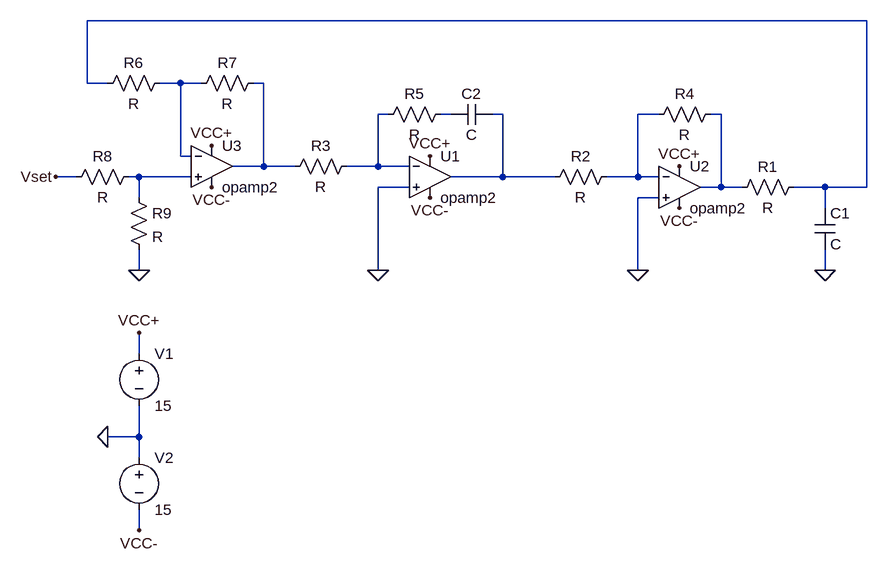
[diagram p0: schematic PI_Nao_imprementado.asc]
PI_Nao_imprementado.asc, the LTspice schematic file:
Version 4
SHEET 1 880 772
WIRE 832 -112 -368 -112
WIRE -368 -16 -368 -112
WIRE -336 -16 -368 -16
WIRE -224 -16 -256 -16
WIRE -192 -16 -224 -16
WIRE -96 -16 -112 -16
WIRE 96 32 80 32
WIRE 192 32 176 32
WIRE 272 32 256 32
WIRE 512 32 480 32
WIRE 608 32 592 32
WIRE -224 96 -224 -16
WIRE -208 96 -224 96
WIRE -96 112 -96 -16
WIRE -96 112 -144 112
WIRE -48 112 -96 112
WIRE 80 112 80 32
WIRE 80 112 32 112
WIRE 128 112 80 112
WIRE -384 128 -416 128
WIRE -288 128 -304 128
WIRE -208 128 -288 128
WIRE 272 128 272 32
WIRE 272 128 192 128
WIRE 352 128 272 128
WIRE 480 128 480 32
WIRE 480 128 432 128
WIRE 512 128 480 128
WIRE 128 144 80 144
WIRE 608 144 608 32
WIRE 608 144 576 144
WIRE 640 144 608 144
WIRE 768 144 720 144
WIRE 832 144 832 -112
WIRE 832 144 768 144
WIRE -288 160 -288 128
WIRE 512 160 480 160
WIRE 768 176 768 144
WIRE -288 272 -288 240
WIRE 80 272 80 144
WIRE 480 272 480 160
WIRE 768 272 768 240
WIRE -288 400 -288 368
WIRE -288 528 -288 480
WIRE -288 528 -336 528
WIRE -288 560 -288 528
WIRE -288 672 -288 640
FLAG 768 272 0
FLAG -288 272 0
FLAG 80 272 0
FLAG 480 272 0
FLAG -416 128 Vset
FLAG -176 80 VCC+
FLAG 160 96 VCC+
FLAG 544 112 VCC+
FLAG -176 144 VCC-
FLAG 160 160 VCC-
FLAG 544 176 VCC-
FLAG -336 528 0
FLAG -288 672 VCC-
FLAG -288 368 VCC+
SYMBOL OpAmps\\opamp2 160 64 R0
SYMATTR InstName U1
SYMBOL OpAmps\\opamp2 544 80 R0
SYMATTR InstName U2
SYMBOL OpAmps\\opamp2 -176 48 R0
SYMATTR InstName U3
SYMBOL cap 752 176 R0
SYMATTR InstName C1
SYMBOL res 736 128 R90
WINDOW 0 0 56 VBottom 2
WINDOW 3 32 56 VTop 2
SYMATTR InstName R1
SYMBOL res 448 112 R90
WINDOW 0 0 56 VBottom 2
WINDOW 3 32 56 VTop 2
SYMATTR InstName R2
SYMBOL res 48 96 R90
WINDOW 0 0 56 VBottom 2
WINDOW 3 32 56 VTop 2
SYMATTR InstName R3
SYMBOL res 608 16 R90
WINDOW 0 0 56 VBottom 2
WINDOW 3 32 56 VTop 2
SYMATTR InstName R4
SYMBOL res 192 16 R90
WINDOW 0 0 56 VBottom 2
WINDOW 3 32 56 VTop 2
SYMATTR InstName R5
SYMBOL cap 256 16 R90
WINDOW 0 0 32 VBottom 2
WINDOW 3 32 32 VTop 2
SYMATTR InstName C2
SYMBOL res -240 -32 R90
WINDOW 0 0 56 VBottom 2
WINDOW 3 32 56 VTop 2
SYMATTR InstName R6
SYMBOL res -96 -32 R90
WINDOW 0 0 56 VBottom 2
WINDOW 3 32 56 VTop 2
SYMATTR InstName R7
SYMBOL res -288 112 R90
WINDOW 0 0 56 VBottom 2
WINDOW 3 32 56 VTop 2
SYMATTR InstName R8
SYMBOL voltage -288 384 R0
WINDOW 123 0 0 Left 0
WINDOW 39 0 0 Left 0
SYMATTR InstName V1
SYMATTR Value 15
SYMBOL voltage -288 544 R0
WINDOW 123 0 0 Left 0
WINDOW 39 0 0 Left 0
SYMATTR InstName V2
SYMATTR Value 15
SYMBOL res -304 144 R0
SYMATTR InstName R9

The netlist it stands for:
* PI_Nao_imprementado.asc
XU1 0 N004 VCC+ VCC- N006 opamp2  ; pins In+ In- V+ V- OUT
XU2 0 N007 VCC+ VCC- N008 opamp2  ; pins In+ In- V+ V- OUT
XU3 N009 N002 VCC+ VCC- N003 opamp2  ; pins In+ In- V+ V- OUT
C1 N001 0 C
R1 N001 N008 R
R2 N007 N006 R
R3 N004 N003 R
R4 N008 N007 R
R5 N005 N004 R
C2 N006 N005 C
R6 N002 N001 R
R7 N003 N002 R
R8 N009 Vset R
V1 VCC+ 0 15
V2 0 VCC- 15
R9 N009 0 R
.backanno
.end